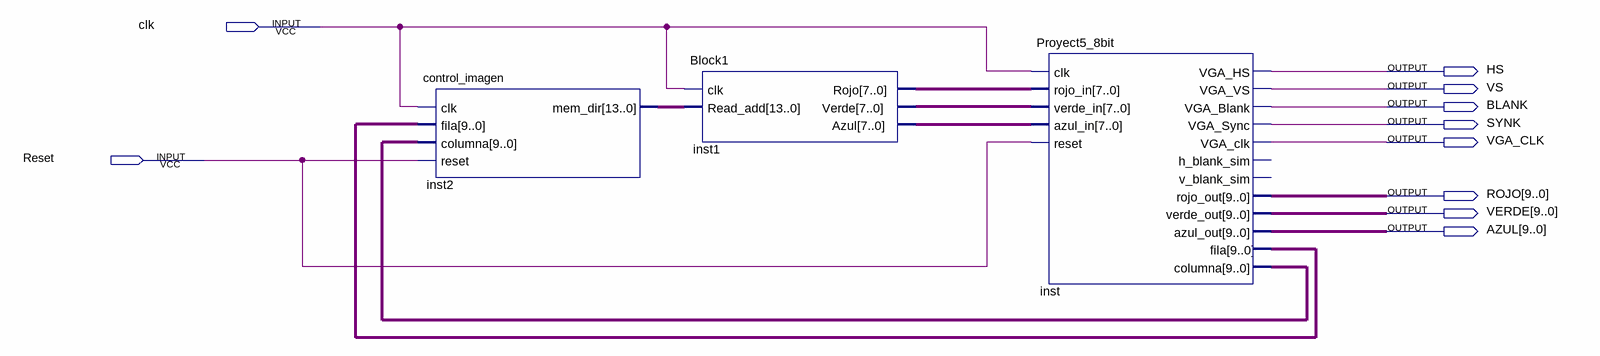
[diagram p0: schematic sheet]
// Quartus schematic d.bdf as structural Verilog: 3 symbols, 10 pins
module d (
  input  clk,
  input  Reset,
  output HS,
  output VS,
  output BLANK,
  output SYNK,
  output VGA_CLK,
  output [9:0] ROJO,
  output [9:0] VERDE,
  output [9:0] AZUL
);

  wire [7:0] inst1_azul, inst1_rojo, inst1_verde;
  wire [9:0] inst_columna, inst_fila;
  wire [13:0] inst2_mem_dir;

  control_imagen inst2 (.clk(clk), .fila(inst_fila), .columna(inst_columna), .reset(Reset), .mem_dir(inst2_mem_dir));
  Block1 inst1 (.clk(clk), .Read_add(inst2_mem_dir), .Rojo(inst1_rojo), .Verde(inst1_verde), .Azul(inst1_azul));
  Proyect5_8bit inst (
    .clk(clk), .rojo_in(inst1_rojo), .verde_in(inst1_verde), .azul_in(inst1_azul), .reset(Reset),
    .VGA_HS(HS), .VGA_VS(VS), .VGA_Blank(BLANK), .VGA_Sync(SYNK), .VGA_clk(VGA_CLK), .rojo_out(ROJO),
    .verde_out(VERDE), .azul_out(AZUL), .fila(inst_fila), .columna(inst_columna));  // open: h_blank_sim, v_blank_sim
endmodule
